# EAGLE design FubarStep_v11 (EAGLE 6.4)
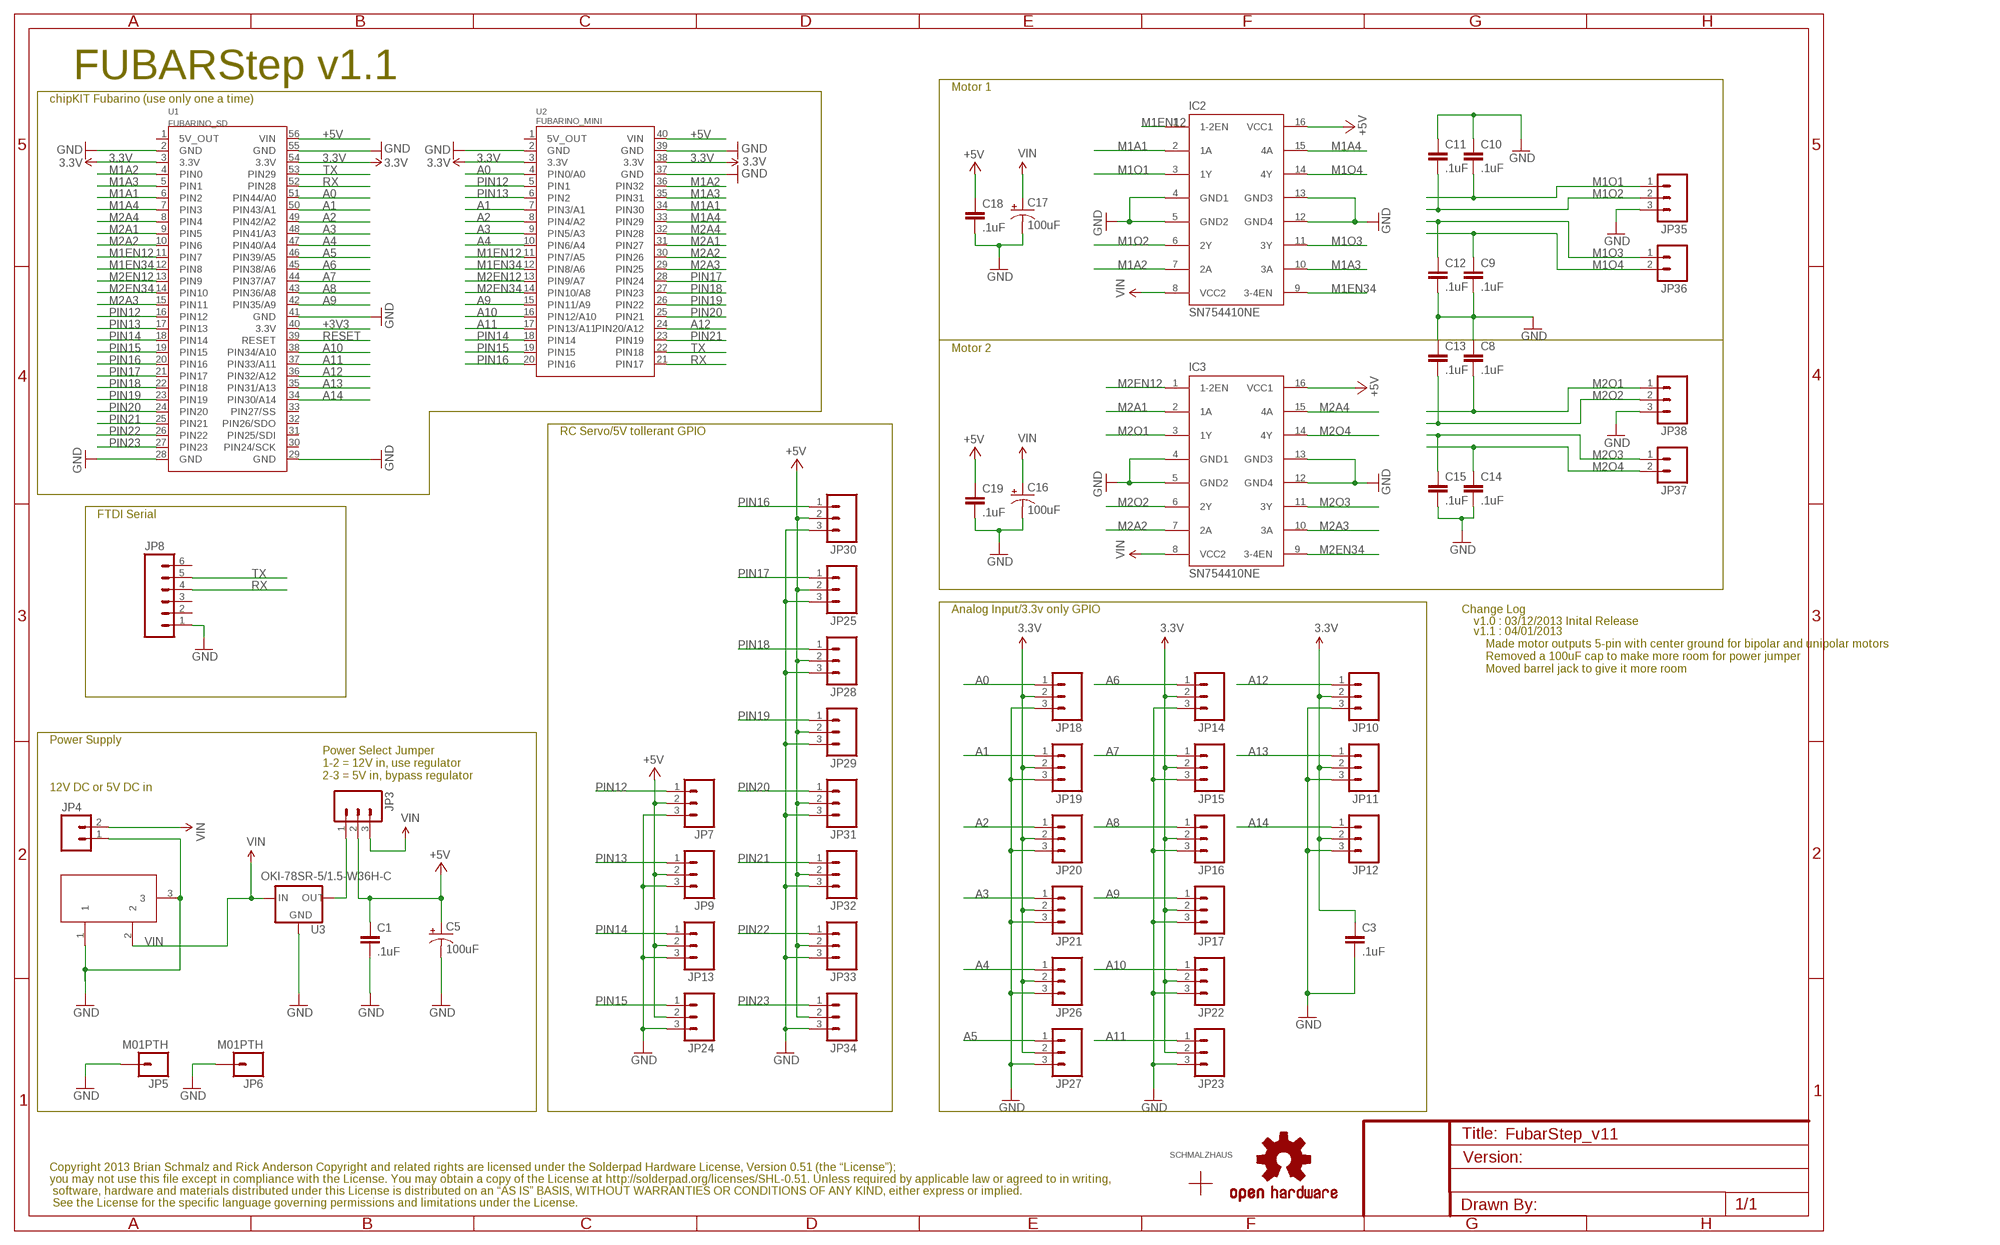
[diagram p0: schematic, sheet 1]

## Parts
C1  .1uF  CAPPTH  [CAP-PTH-SMALL]
C3  .1uF  CAPPTH  [CAP-PTH-SMALL]
C5  100uF  CAP_POLPTH1  [CPOL-RADIAL-100UF-25V]
C8  .1uF  CAPPTH  [CAP-PTH-SMALL]
C9  .1uF  CAPPTH  [CAP-PTH-SMALL]
C10  .1uF  CAPPTH  [CAP-PTH-SMALL]
C11  .1uF  CAPPTH  [CAP-PTH-SMALL]
C12  .1uF  CAPPTH  [CAP-PTH-SMALL]
C13  .1uF  CAPPTH  [CAP-PTH-SMALL]
C14  .1uF  CAPPTH  [CAP-PTH-SMALL]
C15  .1uF  CAPPTH  [CAP-PTH-SMALL]
C16  100uF  CAP_POLPTH1  [CPOL-RADIAL-100UF-25V]
C17  100uF  CAP_POLPTH1  [CPOL-RADIAL-100UF-25V]
C18  .1uF  CAPPTH  [CAP-PTH-SMALL]
C19  .1uF  CAPPTH  [CAP-PTH-SMALL]
IC2  SN754410NE  L293E  [DIL16]
IC3  SN754410NE  L293E  [DIL16]
JP3  M03PTH  [1X03]
JP4  M023.5MM  [SCREWTERMINAL-3.5MM-2]
JP5  M01PTH  [1X01]
JP6  M01PTH  [1X01]
JP7  M03PTH  [1X03]
JP8  M06LOCK  [1X06_LOCK]
JP9  M03PTH  [1X03]
JP10  M03PTH  [1X03]
JP11  M03PTH  [1X03]
JP12  M03PTH  [1X03]
JP13  M03PTH  [1X03]
JP14  M03PTH  [1X03]
JP15  M03PTH  [1X03]
JP16  M03PTH  [1X03]
JP17  M03PTH  [1X03]
JP18  M03PTH  [1X03]
JP19  M03PTH  [1X03]
JP20  M03PTH  [1X03]
JP21  M03PTH  [1X03]
JP22  M03PTH  [1X03]
JP23  M03PTH  [1X03]
JP24  M03PTH  [1X03]
JP25  M03PTH  [1X03]
JP26  M03PTH  [1X03]
JP27  M03PTH  [1X03]
JP28  M03PTH  [1X03]
JP29  M03PTH  [1X03]
JP30  M03PTH  [1X03]
JP31  M03PTH  [1X03]
JP32  M03PTH  [1X03]
JP33  M03PTH  [1X03]
JP34  M03PTH  [1X03]
JP35  M03SCREW  [SCREWTERMINAL-3.5MM-3]
JP36  M023.5MM  [SCREWTERMINAL-3.5MM-2]
JP37  M023.5MM  [SCREWTERMINAL-3.5MM-2]
JP38  M03SCREW  [SCREWTERMINAL-3.5MM-3]
LOGO1  OSHW-LOGOM  [OSHW-LOGO-M]
U1  FUBARINO_SD  [FUBARINO_SD]
U2  FUBARINO_MINI  [FUBARINO_MINI]
U3  OKI-78SR-5/1.5-W36H-C  V_REG_78XXSINK  [TO220-IGO]
U$1  SCHMALZHAUSSCHMALZHAUS_SMALL  [SCHMALZHAUS_SMALL]
X1  DC21MMX  [DC-21MM]

## Nets
3.3V: C3.1 JP10.2 JP11.2 JP12.2 JP14.2 JP15.2 JP16.2 JP17.2 JP18.2 JP19.2 JP20.2 JP21.2 JP22.2 JP23.2 JP26.2 JP27.2 U1.3(3.3V) U1.54(3.3V) U2.3(3.3V) U2.38(3.3V)
+3V3: U1.40(3.3V)
+5V: C1.1 C5.1(+) C18.1 C19.1 IC2.16(VCC1) IC3.16(VCC1) JP3.2 JP7.2 JP9.2 JP13.2 JP24.2 JP25.2 JP28.2 JP29.2 JP30.2 JP31.2 JP32.2 JP33.2 JP34.2 U1.56(VIN) U2.40(VIN)
A0: JP18.1 U1.51(PIN44/A0) U2.4(PIN0/A0)
A1: JP19.1 U1.50(PIN43/A1) U2.7(PIN3/A1)
A2: JP20.1 U1.49(PIN42/A2) U2.8(PIN4/A2)
A3: JP21.1 U1.48(PIN41/A3) U2.9(PIN5/A3)
A4: JP26.1 U1.47(PIN40/A4) U2.10(PIN6/A4)
A5: JP27.1 U1.46(PIN39/A5)
A6: JP14.1 U1.45(PIN38/A6)
A7: JP15.1 U1.44(PIN37/A7)
A8: JP16.1 U1.43(PIN36/A8)
A9: JP17.1 U1.42(PIN35/A9) U2.15(PIN11/A9)
A10: JP22.1 U1.38(PIN34/A10) U2.16(PIN12/A10)
A11: JP23.1 U1.37(PIN33/A11) U2.17(PIN13/A11)
A12: JP10.1 U1.36(PIN32/A12) U2.24(PIN20/A12)
A13: JP11.1 U1.35(PIN31/A13)
A14: JP12.1 U1.34(PIN30/A14)
GND: C1.2 C3.2 C5.2(-) C8.1 C9.2 C10.1 C11.1 C12.2 C13.1 C14.2 C15.2 C16.2(-) C17.2(-) C18.2 C19.2 IC2.4(GND1) IC2.5(GND2) IC2.12(GND4) IC2.13(GND3) IC3.4(GND1) IC3.5(GND2) IC3.12(GND4) IC3.13(GND3) JP4.1 JP5.1 JP6.1 JP7.3 JP8.1 JP9.3 JP10.3 JP11.3 JP12.3 JP13.3 JP14.3 JP15.3 JP16.3 JP17.3 JP18.3 JP19.3 JP20.3 JP21.3 JP22.3 JP23.3 JP24.3 JP25.3 JP26.3 JP27.3 JP28.3 JP29.3 JP30.3 JP31.3 JP32.3 JP33.3 JP34.3 JP35.3 JP38.3 U1.2(GND) U1.28(GND) U1.29(GND) U1.41(GND) U1.55(GND) U2.2(GND) U2.37(GND) U2.39(GND) U3.GND X1.1 X1.3
M1A1: IC2.2(1A) U1.6(PIN2) U2.34(PIN30)
M1A2: IC2.7(2A) U1.4(PIN0) U2.36(PIN32)
M1A3: IC2.10(3A) U1.5(PIN1) U2.35(PIN31)
M1A4: IC2.15(4A) U1.7(PIN3) U2.33(PIN29)
M1EN12: IC2.1(1-2EN) U1.11(PIN7) U2.11(PIN7/A5)
M1EN34: IC2.9(3-4EN) U1.12(PIN8) U2.12(PIN8/A6)
M1O1: C10.2 IC2.3(1Y) JP35.1
M1O2: C11.2 IC2.6(2Y) JP35.2
M1O3: C12.1 IC2.11(3Y) JP36.1
M1O4: C9.1 IC2.14(4Y) JP36.2
M2A1: IC3.2(1A) U1.9(PIN5) U2.31(PIN27)
M2A2: IC3.7(2A) U1.10(PIN6) U2.30(PIN26)
M2A3: IC3.10(3A) U1.15(PIN11) U2.29(PIN25)
M2A4: IC3.15(4A) U1.8(PIN4) U2.32(PIN28)
M2EN12: IC3.1(1-2EN) U1.13(PIN9) U2.13(PIN9/A7)
M2EN34: IC3.9(3-4EN) U1.14(PIN10) U2.14(PIN10/A8)
M2O1: C8.2 IC3.3(1Y) JP38.1
M2O2: C13.2 IC3.6(2Y) JP38.2
M2O3: C15.1 IC3.11(3Y) JP37.1
M2O4: C14.1 IC3.14(4Y) JP37.2
N$2: JP3.1 U3.OUT
PIN12: JP7.1 U1.16(PIN12) U2.5(PIN1)
PIN13: JP9.1 U1.17(PIN13) U2.6(PIN2)
PIN14: JP13.1 U1.18(PIN14) U2.18(PIN14)
PIN15: JP24.1 U1.19(PIN15) U2.19(PIN15)
PIN16: JP30.1 U1.20(PIN16) U2.20(PIN16)
PIN17: JP25.1 U1.21(PIN17) U2.28(PIN24)
PIN18: JP28.1 U1.22(PIN18) U2.27(PIN23)
PIN19: JP29.1 U1.23(PIN19) U2.26(PIN22)
PIN20: JP31.1 U1.24(PIN20) U2.25(PIN21)
PIN21: JP32.1 U1.25(PIN21) U2.23(PIN19)
PIN22: JP33.1 U1.26(PIN22)
PIN23: JP34.1 U1.27(PIN23)
RESET: U1.39(RESET)
RX: JP8.4 U1.52(PIN28) U2.21(PIN17)
TX: JP8.5 U1.53(PIN29) U2.22(PIN18)
VIN: C16.1(+) C17.1(+) IC2.8(VCC2) IC3.8(VCC2) JP3.3 JP4.2 U3.IN X1.2
Unconnected: JP8.2 JP8.3 JP8.6 U1.1(5V_OUT) U1.30(PIN24/SCK) U1.31(PIN25/SDI) U1.32(PIN26/SDO) U1.33(PIN27/SS) U2.1(5V_OUT)

## Notes on the sheet
- FUBARStep v1.1
- Motor 1
- chipKIT Fubarino (use only one a time)
- Motor 2
- RC Servo/5V tollerant GPIO
- FTDI Serial
- Analog Input/3.3v only GPIO | Change Log
- v1.0 : 03/12/2013 Inital Release
- v1.1 : 04/01/2013
      Made motor outputs 5-pin with center ground for bipolar and unipolar motors
      Removed a 100uF cap to make more room for power jumper
      Moved barrel jack to give it more room
- Power Supply
- Power Select Jumper
  1-2 = 12V in, use regulator
  2-3 = 5V in, bypass regulator
- 12V DC or 5V DC in
- Copyright 2013 Brian Schmalz and Rick Anderson Copyright and related rights are licensed under the Solderpad Hardware License, Version 0.51 (the “License”);
- you may not use this file except in compliance with the License. You may obtain a copy of the License at http://solderpad.org/licenses/SHL-0.51. Unless required by applicable law or agreed to in writing,
- software, hardware and materials distributed under this License is distributed on an “AS IS” BASIS, WITHOUT WARRANTIES OR CONDITIONS OF ANY KIND, either express or implied.
- See the License for the specific language governing permissions and limitations under the License.

## Library data of the parts
C1 C3 C8-C15 C18 C19 = SparkFun-Capacitors:CAP: Capacitor Standard 0603 ceramic capacitor, and 0.1" leaded capacitor.
C5 C16 C17 = SparkFun-Capacitors:CAP_POL: Capacitor Polarized These are standard SMD and PTH capacitors. Normally 10uF, 47uF, and 100uF in electrolytic and tantalum varieties. Always verify the external diameter of the through hole cap, it varies with capacity, voltage, and manufacturer. The EIA devices should be standard.
IC2 IC3 = texas:L293E: TI DEVICE; MF: Arrow Electronics; MPN: L293E; OC_FARNELL: 1467711; OC_NEWARK: 89K0732
JP3 JP7 JP9-JP35 JP38 = SparkFun-Connectors:M03: Header 3 Standard 3-pin 0.1" header. Use with straight break away headers (SKU : PRT-00116), right angle break away headers (PRT-00553), swiss pins (PRT-00743), machine pins (PRT-00117), and female headers (PRT-00115). Molex polarized connector foot print use with SKU : PRT-08232 with associated crimp pins and housings.
JP4 JP36 JP37 = SparkFun-Connectors:M02: Header 2 Standard 2-pin 0.1" header. Use with straight break away headers (SKU : PRT-00116), right angle break away headers (PRT-00553), swiss pins (PRT-00743), machine pins (PRT-00117), and female headers (PRT-00115). Molex polarized connector foot print use with SKU : PRT-08233 with associated crimp pins and housings.
JP5 JP6 = SparkFun-Connectors:M01: Header 1 Standard 1-pin 0.1" header. Use with straight break away headers (SKU : PRT-00116), right angle break away headers (PRT-00553), swiss pins (PRT-00743), machine pins (PRT-00117), and female headers (PRT-00115).
JP8 = SparkFun-Connectors:M06: Header 6 Standard 6-pin 0.1" header. Use with straight break away headers (SKU : PRT-00116), right angle break away headers (PRT-00553), swiss pins (PRT-00743), machine pins (PRT-00117), and female headers (PRT-00115). Molex polarized connector foot print use with SKU : PRT-08094 with associated crimp pins and housings. NOTES ON THE VARIANTS LOCK and LOCK_LONGPADS... This footprint was designed to help hold the alignment of a through-hole component (i.e. 6-pin header) while soldering it into place. You may notice that each hole has been shifted either up or down by 0.005 of an inch from it's more standard position (which is a perfectly straight line). This slight alteration caused the pins (the squares in the middle) to touch the edges of the holes. Because they are alternating, it causes a "brace" to hold the component in place. 0.005 has proven to be the perfect amount of "off-center" position when using our standard breakaway headers. Although looks a little odd when you look at the bare footprint, once you have a header in there, the alteration is very hard to notice. Also, if you push a header all the way into place, it is covered up entirely on the bottom side. This idea of altering the position of holes to aid alignment will be further integrated into the Sparkfun Library for other footprints. It can help hold any component with 3 or more connection pins.
LOGO1 = SparkFun-Aesthetics:OSHW-LOGO: Open Source Hardware Logo This logo indicates the piece of hardware it is found on incorporates a OSHW license and/or adheres to the definition of open source hardware found here: http://freedomdefined.org/OSHW
U1 = SchmalzHausPublic:FUBARINO_SD
U2 = SchmalzHausPublic:FUBARINO_MINI
U3 = SparkFun-PowerIC:V_REG_78XX: Voltage Regulator Standard 7805 5V regulator. IGO (Input Ground Output). Spark Fun Electronics SKU : COM-00107
U$1 = SchmalzHaus:SCHMALZHAUS
X1 = powersupply:DC21MM

## Net classes
0 default: width 0.152 mm, drill 0.305 mm, clearance 0.152 mm

## Board
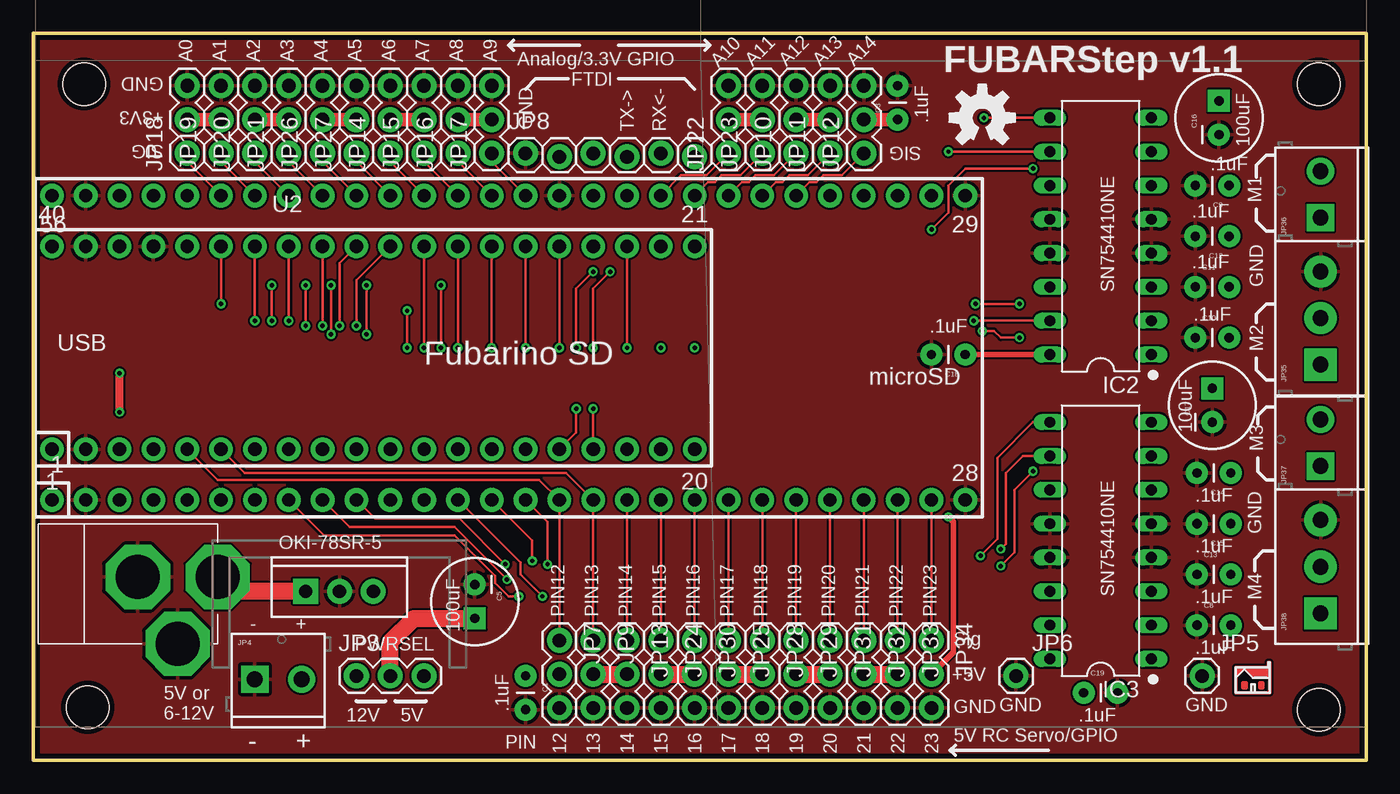
[diagram p1: board, top side]
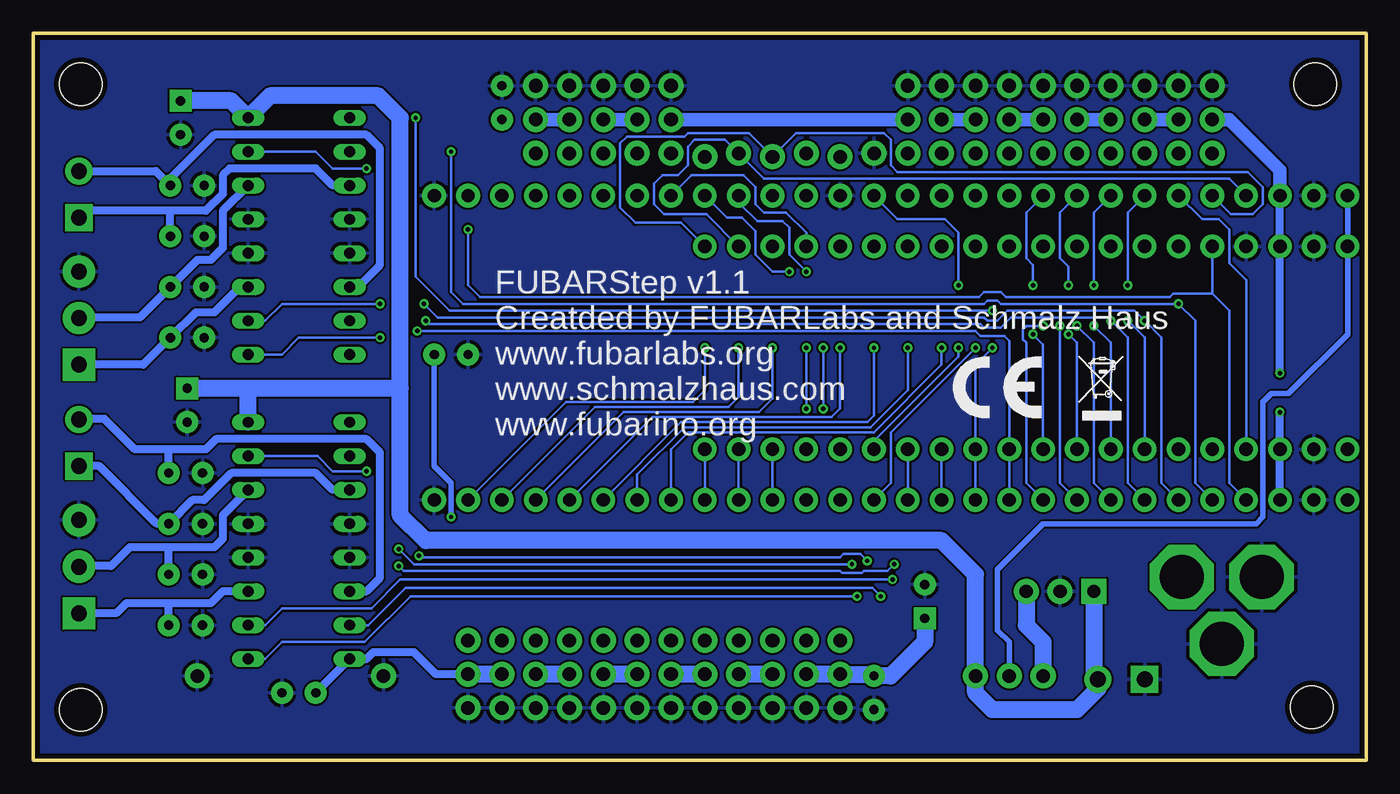
[diagram p2: board, bottom side, seen from below]

Size 100.08 x 54.61 mm. Coordinates in mm from the lower left corner, seen from the top.
Outline: 0,54.61 100.08,54.61 100.08,0 0,0 0,54.61
Copper layers (1*16): Top 0.0356mm / dielectric 1.5011mm / Bottom 0.0356mm
Design rules "LaenPCBOrder_BPSmods": minimum track width 6mil, minimum drill 13mil, track to track 6mil, track to pad 6mil, pad to pad 6mil, via to via 6mil, smd to smd 6mil, copper to edge 15mil, drill to drill 6mil, minimum pad ring 7mil, minimum via ring 7mil, stop-mask expansion 4mil, vias tented up to drill 30mil, thermal gap 10mil
Holes 3.2 mm at 96.52,50.8 96.52,3.81 3.81,50.8 4.08,3.98

### Footprints (pad centres in the part's own frame; a part is rotated, then mirrored left to right if it is on the bottom)
CAP-PTH-SMALL = drill 0.7 pad 1.651: 1 0,0; 2 2.54,0
CPOL-RADIAL-100UF-25V = drill 0.7 pad 1.651 square: 1 1.27,0 | drill 0.7 pad 1.651: 2 -1.27,0
DIL16 = drill 0.813 long: 1 -8.89,-3.81; 2 -6.35,-3.81; 3 -3.81,-3.81; 4 -1.27,-3.81; 5 1.27,-3.81; 6 3.81,-3.81; 7 6.35,-3.81; 8 8.89,-3.81; 9 8.89,3.81; 10 6.35,3.81; 11 3.81,3.81; 12 1.27,3.81; 13 -1.27,3.81; 14 -3.81,3.81; 15 -6.35,3.81; 16 -8.89,3.81
1X03 = drill 1.016 pad 1.88: 1 0,0; 2 2.54,0; 3 5.08,0
SCREWTERMINAL-3.5MM-2 = drill 1.2 pad 2.032 square: 1 0,0 | drill 1.2 pad 2.032: 2 3.5,0
1X01 = drill 1.016 pad 1.88: 1 0,0
1X06_LOCK = drill 1.016 pad 1.88: 1 0,0; 2 2.54,-0.254; 3 5.08,0; 4 7.62,-0.254; 5 10.16,0; 6 12.7,-0.254
SCREWTERMINAL-3.5MM-3 = drill 1.2 pad 2.413 square: 1 0,0 | drill 1.2 pad 2.413: 2 3.5,0; 3 7,0
FUBARINO_SD = drill 1 pad 1.778: 1 -34.29,-11.43; 2 -31.75,-11.43; 3 -29.21,-11.43; 4 -26.67,-11.43; 5 -24.13,-11.43; 6 -21.59,-11.43; 7 -19.05,-11.43; 8 -16.51,-11.43; 9 -13.97,-11.43; 10 -11.43,-11.43; 11 -8.89,-11.43; 12 -6.35,-11.43; 13 -3.81,-11.43; 14 -1.27,-11.43; 15 1.27,-11.43; 16 3.81,-11.43; 17 6.35,-11.43; 18 8.89,-11.43; 19 11.43,-11.43; 20 13.97,-11.43; 21 16.51,-11.43; 22 19.05,-11.43; 23 21.59,-11.43; 24 24.13,-11.43; 25 26.67,-11.43; 26 29.21,-11.43; 27 31.75,-11.43; 28 34.29,-11.43; 29 34.29,11.43; 30 31.75,11.43; 31 29.21,11.43; 32 26.67,11.43; 33 24.13,11.43; 34 21.59,11.43; 35 19.05,11.43; 36 16.51,11.43; 37 13.97,11.43; 38 11.43,11.43; 39 8.89,11.43; 40 6.35,11.43; 41 3.81,11.43; 42 1.27,11.43; 43 -1.27,11.43; 44 -3.81,11.43; 45 -6.35,11.43; 46 -8.89,11.43; 47 -11.43,11.43; 48 -13.97,11.43; 49 -16.51,11.43; 50 -19.05,11.43; 51 -21.59,11.43; 52 -24.13,11.43; 53 -26.67,11.43; 54 -29.21,11.43; 55 -31.75,11.43; 56 -34.29,11.43
FUBARINO_MINI = drill 1 pad 1.778: 1 -24.13,-7.62; 2 -21.59,-7.62; 3 -19.05,-7.62; 4 -16.51,-7.62; 5 -13.97,-7.62; 6 -11.43,-7.62; 7 -8.89,-7.62; 8 -6.35,-7.62; 9 -3.81,-7.62; 10 -1.27,-7.62; 11 1.27,-7.62; 12 3.81,-7.62; 13 6.35,-7.62; 14 8.89,-7.62; 15 11.43,-7.62; 16 13.97,-7.62; 17 16.51,-7.62; 18 19.05,-7.62; 19 21.59,-7.62; 20 24.13,-7.62; 21 24.13,7.62; 22 21.59,7.62; 23 19.05,7.62; 24 16.51,7.62; 25 13.97,7.62; 26 11.43,7.62; 27 8.89,7.62; 28 6.35,7.62; 29 3.81,7.62; 30 1.27,7.62; 31 -1.27,7.62; 32 -3.81,7.62; 33 -6.35,7.62; 34 -8.89,7.62; 35 -11.43,7.62; 36 -13.97,7.62; 37 -16.51,7.62; 38 -19.05,7.62; 39 -21.59,7.62; 40 -24.13,7.62
TO220-IGO = drill 1 pad 1.88: GND 0,0; OUT 2.54,0 | drill 1 pad 1.88 square: IN -2.54,0
DC-21MM = drill 3.302 pad 4.826 octagon: 1 -5.08,-3.353; 2 -0.076,-6.35; 3 -0.076,-0.356

### Placement (x,y rotation side)
C1  36.96,6.35 270 top
C3  64.9,48.13 90 top
C5  33.15,11.94 270 top
C8  87.38,10.16 0 top
C9  89.79,43.18 180 top
C10  87.25,31.75 0 top
C11  87.25,35.56 0 top
C12  89.79,39.37 180 top
C13  87.38,13.97 0 top
C14  89.92,21.59 180 top
C15  89.92,17.78 180 top
C16  89.03,48.26 90 top
C17  88.52,26.67 90 top
C18  69.98,30.48 180 top
C19  78.87,5.08 0 top
IC2  80.14,39.37 90 top
IC3  80.14,16.51 90 top
JP3  24.26,6.35 0 top
JP4  16.64,6.1 0 top
JP5  87.76,6.35 0 top
JP6  73.79,6.35 0 top
JP7  39.5,9.02 270 top
JP8  36.96,45.59 0 top
JP9  42.04,9.02 270 top
JP10  57.28,45.59 90 top
JP11  59.82,45.59 90 top
JP12  62.36,45.59 90 top
JP13  44.58,9.02 270 top
JP14  26.8,45.59 90 top
JP15  29.34,45.59 90 top
JP16  31.88,45.59 90 top
JP17  34.42,45.59 90 top
JP18  11.56,45.59 90 top
JP19  14.1,45.59 90 top
JP20  16.64,45.59 90 top
JP21  19.18,45.59 90 top
JP22  52.2,45.59 90 top
JP23  54.74,45.59 90 top
JP24  47.12,9.02 270 top
JP25  52.2,9.02 270 top
JP26  21.72,45.59 90 top
JP27  24.26,45.59 90 top
JP28  54.74,9.02 270 top
JP29  57.28,9.02 270 top
JP30  49.66,9.02 270 top
JP31  59.82,9.02 270 top
JP32  62.36,9.02 270 top
JP33  64.9,9.02 270 top
JP34  67.44,9.02 270 top
JP35  96.65,29.72 90 top
JP36  96.65,40.77 90 top
JP37  96.65,22.1 90 top
JP38  96.65,11.05 90 top
LOGO1  71.25,48.26 0 top
U1  35.69,30.99 0 top
U2  25.53,30.99 0 top
U3  22.99,12.7 0 top
U$1  91.57,5.08 0 top
U$2  [ROHS_GARBAGE_5MM]  21.59,25.53 0 bottom
U$3  [CE_5MM]  27.69,28.07 0 bottom
X1  7.49,13.84 90 top

### Tracks (layer width: path | path; a pad name or v marks a point on that pad's centre or on a via)
3.3V  (via drill 0.33)
  Top 0.61: v6.48,26.16 v6.48,29.08
  Top 1.016: C3.1 JP12.2 | JP11.2 JP10.2 | JP23.2 JP22.2 | JP17.2 JP16.2 | JP15.2 JP14.2 | JP27.2 JP26.2 | JP21.2 JP20.2 | JP19.2 JP18.2
  Bottom 0.61: U1.3 U2.3 v6.48,26.16 | U1.54 U2.38 v6.48,29.08
  Bottom 1.016: U1.54 6.48,44.32 10.29,48.13 JP18.2 | JP19.2 JP20.2 | JP21.2 JP26.2 | JP27.2 JP14.2 | JP15.2 JP16.2 | JP17.2 JP22.2 | JP23.2 JP10.2 | JP11.2 JP12.2
+5V  (via drill 0.33)
  Top 0.406: JP34.2 69.09,8.13 69.09,17.91 v68.71,18.29 | C18.1 IC2.16
  Top 1.27: JP9.2 JP13.2 | JP24.2 JP30.2 | JP25.2 JP28.2 | JP29.2 JP31.2 | JP32.2 JP33.2 | JP3.2 26.8,8.89 28.57,10.67 C5.1
  Bottom 0.203: 37.08,6.48 C1.1
  Bottom 0.406: U1.56 U2.40 1.4,32 5.84,27.56 7.11,27.56 7.75,26.92 7.75,18.29 8.26,17.78 24.26,17.78 27.69,14.35 27.69,9.78 26.8,8.89 JP3.2 | v68.71,18.29 68.71,20.83 69.98,22.1 C18.1
  Bottom 0.61: JP34.2 69.85,6.48 71.5,8.13 74.55,8.13 75.06,7.62 IC3.16 C19.1
  Bottom 1.27: JP9.2 JP7.2 37.08,6.48 | JP13.2 JP24.2 | JP30.2 JP25.2 | JP28.2 JP29.2 | JP31.2 JP32.2 | JP33.2 JP34.2 | C5.1 33.15,8.89 35.69,6.35 C1.1
A0
  Top 0.152: U1.51 11.56,44.96 JP18.1
  Bottom 0.203: U2.4 9.02,36.07 10.29,37.34 10.29,39.88 11.05,40.64 12.32,40.64 U1.51
A1  (via drill 0.33)
  Top 0.152: U1.50 14.1,44.96 JP19.1
  Top 0.203: v17.91,33.02 v17.91,35.69
  Bottom 0.203: U2.7 16.64,31.75 v17.91,33.02 | v17.91,35.69 17.91,41.15 U1.50
A2  (via drill 0.33)
  Top 0.152: U1.49 16.64,44.96 JP20.1
  Top 0.203: v20.45,32.64 v20.45,35.69
  Bottom 0.203: U2.8 19.18,31.37 v20.45,32.64 | v20.45,35.69 20.45,41.15 U1.49
A3  (via drill 0.33)
  Top 0.152: U1.48 19.18,44.96 JP21.1
  Top 0.203: v22.35,32 v22.35,35.69
  Bottom 0.203: U2.9 21.72,31.37 v22.35,32 | v22.35,35.69 22.35,37.08 22.99,37.72 22.99,41.15 U1.48
A4  (via drill 0.33)
  Top 0.152: U1.47 21.72,44.96 JP26.1
  Top 0.203: v25.02,32 v25.02,35.69
  Bottom 0.203: U2.10 24.26,31.24 v25.02,32 | v25.02,35.69 25.02,37.21 25.53,37.72 25.53,41.15 U1.47
A5
  Top 0.152: U1.46 24.26,44.96 JP27.1
A6
  Top 0.152: U1.45 26.8,44.96 JP14.1
A7
  Top 0.152: U1.44 29.34,44.96 JP15.1
A8
  Top 0.152: U1.43 31.88,44.96 JP16.1
A9  (via drill 0.33)
  Top 0.152: U1.42 34.42,44.96 JP17.1
  Top 0.203: v30.61,30.99 v30.61,35.69
  Bottom 0.203: U2.15 36.96,24 30.61,30.35 v30.61,30.99 | v30.61,35.69 30.61,39.62 31.62,40.64 35.18,40.64 U1.42
A10  (via drill 0.33)
  Top 0.203: U1.38 48.64,43.94 50.55,43.94 JP22.1 | U2.16 40.77,24.64 v40.77,26.42 | v40.77,30.99 40.77,35.43 v42.04,36.7
  Bottom 0.203: v40.77,26.42 v40.77,30.99 | v42.04,36.7 43.31,37.97 43.31,40.01 43.82,40.51 45.72,40.51 47.12,41.91 U1.38
A11  (via drill 0.33)
  Top 0.203: U1.37 50.67,43.43 51.18,43.43 51.69,43.94 53.09,43.94 JP23.1 | U2.17 v42.04,26.42 | v42.04,30.99 42.04,35.43 v43.31,36.7
  Bottom 0.203: v42.04,26.42 v42.04,30.99 | v43.31,36.7 44.58,36.7 45.85,37.97 45.85,39.75 46.86,40.77 48.01,40.77 U1.37
A12
  Top 0.203: U1.36 53.21,43.43 53.72,43.43 54.23,43.94 55.63,43.94 JP10.1
  Bottom 0.203: U2.24 42.04,39.62 43.56,41.15 45.21,41.15 45.85,41.78 45.85,43.05 46.74,43.94 50.67,43.94 U1.36
A13
  Top 0.203: U1.35 55.75,43.43 56.26,43.43 56.77,43.94 58.17,43.94 JP11.1
A14
  Top 0.203: U1.34 58.29,43.43 58.8,43.43 59.31,43.94 60.71,43.94 JP12.1
GND
  pour Bottom (rank 2): 0,54.61 100.08,54.61 100.08,0 0,0
  pour Top (rank 2): 0,54.61 100.08,54.61 100.08,0 0,0
M1A1  (via drill 0.33)
  Top 0.203: v74.04,34.29 v70.74,34.29 | U2.34 v16.64,33.02
  Bottom 0.203: IC2.2 82.68,33.02 81.41,34.29 v74.04,34.29 | v70.74,34.29 69.72,33.27 28.7,33.27 28.45,33.02 27.69,33.02 26.92,33.78 17.4,33.78 v16.64,33.02 15.37,31.75 15.37,20.83 U1.6
M1A2  (via drill 0.33)
  Top 0.203: v75.06,44.45 69.98,44.45 68.71,43.18 68.71,41.15 v67.44,39.88
  Bottom 0.203: IC2.7 78.87,45.72 77.6,44.45 v75.06,44.45 | v67.44,39.88 67.44,35.69 66.55,34.8 29.08,34.8 28.7,35.18 27.43,35.18 27.05,34.8 14.73,34.8 14.48,35.05 11.56,35.05 | U1.4 10.29,20.83 10.29,33.78 11.56,35.05 | 11.56,35.05 U2.36
M1A3  (via drill 0.33)
  Top 0.203: IC2.10 v68.71,45.72 | U2.35 v14.1,34.29
  Bottom 0.203: v68.71,45.72 68.71,35.18 67.82,34.29 28.7,34.29 28.45,34.54 27.69,34.54 27.43,34.29 v14.1,34.29 12.83,33.02 12.83,20.83 U1.5
M1A4  (via drill 0.33)
  Top 0.203: IC2.15 v70.61,33.02 | U2.33 v19.18,33.02
  Bottom 0.203: v70.61,33.02 70.36,32.77 28.96,32.77 28.7,32.51 27.43,32.51 26.67,33.27 19.43,33.27 v19.18,33.02 17.91,31.75 17.91,20.83 U1.7
M1EN12  (via drill 0.33)
  Top 0.203: v74.04,31.75 72.64,31.75 72.14,32.26 v71.25,32.26
  Bottom 0.203: IC2.1 81.41,30.48 80.14,31.75 v74.04,31.75 | v71.25,32.26 29.34,32.26 28.96,31.88 27.18,31.88 26.8,31.5 U2.11 U1.11
M1EN34  (via drill 0.33)
  Top 0.203: IC2.9 v71.37,48.26 | v28.07,30.99 v28.07,33.78
  Bottom 0.203: v71.37,48.26 71.37,36.32 68.83,33.78 v28.07,33.78 | U1.12 U2.12 29.34,29.72 v28.07,30.99
M1O1
  Bottom 0.61: IC2.3 84.58,35.56 86.49,33.66 87.88,33.66 C10.2 91.82,29.72 JP35.1
M1O2
  Bottom 0.61: IC2.6 85.85,41.27 85.85,38.48 86.74,37.59 87.76,37.59 C11.2 92.07,33.27 96.59,33.27 JP35.2
M1O3
  Bottom 0.61: IC2.11 77.6,43.18 78.87,44.45 85.34,44.45 85.85,43.94 85.85,42.55 87.12,41.27 89.66,41.27 | 89.66,41.27 96.14,41.27 JP36.1 | C12.1 89.79,41.15 89.66,41.27
M1O4
  Bottom 0.61: IC2.14 75.69,35.56 74.04,37.21 74.04,45.97 75.06,46.99 86.49,46.99 89.79,43.69 C9.1 90.88,44.27 JP36.2
M2A1  (via drill 0.33)
  Top 0.203: U1.9 23.75,17.53 31.62,17.53 v35.56,13.59 | U2.31 22.99,37.34 v22.99,32.64
  Bottom 0.203: IC3.2 82.68,10.16 81.41,11.43 74.68,11.43 72.52,13.59 v35.56,13.59 | v22.99,32.64 22.99,20.83 U1.9
M2A2  (via drill 0.33)
  Top 0.203: v75.06,21.72 73.66,20.32 73.66,15.62 v72.64,14.61 | U1.10 25.65,18.16 32,18.16 v35.43,14.73 | U2.30 24.26,36.07 v24.26,32.64
  Bottom 0.203: IC3.7 78.74,22.86 77.6,21.72 v75.06,21.72 | v72.64,14.61 72.26,14.22 39.5,14.22 39.37,14.1 37.85,14.1 37.72,14.22 35.94,14.22 v35.43,14.73 | U1.10 25.53,20.83 25.53,31.37 25.78,31.62 25.78,32.38 25.53,32.64 v24.26,32.64
M2A3  (via drill 0.33)
  Top 0.203: IC3.10 74.3,22.86 73.02,21.59 73.02,16.26 v72.64,15.88 | v38.61,14.73 38.61,17.91 U1.15 | v29.34,30.99 U2.29
  Bottom 0.203: v72.64,15.88 71.5,14.73 v38.61,14.73 | U1.15 35.69,20.83 35.69,24.64 v29.34,30.99
M2A4  (via drill 0.33)
  Top 0.203: U1.8 21.84,16.89 31.62,16.89 34.67,13.84 34.67,13.34 35.69,12.32 v36.45,12.32 | U2.32 v21.72,32.64
  Bottom 0.203: IC3.15 74.93,10.16 72.14,12.95 37.08,12.95 v36.45,12.32 | v21.72,32.64 20.45,31.37 20.45,20.83 U1.8
M2EN12  (via drill 0.33)
  Top 0.203: v38.23,12.32 36.58,13.97 36.58,14.86 U1.13
  Bottom 0.203: IC3.1 82.68,7.62 81.41,8.89 75.18,8.89 71.75,12.32 v38.23,12.32 | U2.13 U1.13
M2EN34  (via drill 0.33)
  Top 0.203: IC3.9 75.06,25.4 72.39,22.73 72.39,16.64 v71.12,15.37 | v37.47,14.99 37.47,16.51 U1.14
  Bottom 0.203: v71.12,15.37 70.99,15.24 39.5,15.24 39.24,15.49 37.97,15.49 v37.47,14.99 | U2.14 U1.14
M2O1
  Bottom 0.61: IC3.3 85.85,12.7 86.74,11.81 89.92,11.81 | 89.92,11.81 93.09,11.81 93.85,11.05 JP38.1 | C8.2 89.92,11.81
M2O2
  Bottom 0.61: IC3.6 85.85,18.41 85.85,16.64 86.49,16 89.92,16 | 89.92,16 92.84,16 94.23,14.61 96.59,14.61 JP38.2 | C13.2 89.92,16
M2O3
  Bottom 0.61: IC3.11 77.6,20.32 78.87,21.59 85.22,21.59 87.25,19.56 88.14,19.56 C15.1 90.8,17.78 95.12,22.1 JP37.1
M2O4
  Bottom 0.61: IC3.14 75.06,12.7 74.04,13.72 74.04,23.11 75.06,24.13 86.36,24.13 87.12,23.37 90.04,23.37 | 90.04,23.37 92.46,23.37 94.74,25.65 96.59,25.65 JP37.2 | C14.1 89.92,23.24 90.04,23.37
N$2
  Bottom 1.27: U3.OUT 25.53,10.16 24.26,8.89 JP3.1
PIN12
  Top 0.203: JP7.1 U1.16 37.97,21.08 13.84,21.08 U2.5
PIN13
  Top 0.203: JP9.1 U1.17 40.01,21.59 15.88,21.59 U2.6
PIN14
  Top 0.203: U1.18 JP13.1
  Bottom 0.203: U2.18 U1.18
PIN15
  Top 0.203: U1.19 JP24.1
  Bottom 0.203: U2.19 U1.19
PIN16
  Top 0.203: JP30.1 U1.20
  Bottom 0.203: U2.20 U1.20
PIN17  (via drill 0.33)
  Top 0.203: JP25.1 U1.21 | U2.28 v31.88,30.99
  Bottom 0.203: v31.88,30.99 31.88,29.72 36.96,24.64 50.93,24.64 52.2,23.37 U1.21
PIN18  (via drill 0.33)
  Top 0.203: U1.22 JP28.1 | U2.27 v34.42,30.99
  Bottom 0.203: v34.42,30.99 34.42,27.81 37.21,25.02 51.18,25.02 54.74,21.46 U1.22
PIN19  (via drill 0.33)
  Top 0.203: JP29.1 U1.23 | U2.26 v36.96,30.99
  Bottom 0.203: v36.96,30.99 36.96,25.91 37.47,25.4 51.44,25.4 U1.23
PIN20  (via drill 0.33)
  Top 0.203: U1.24 JP31.1 | U2.25 v39.5,30.99
  Bottom 0.203: v39.5,30.99 39.5,26.42 40.13,25.78 53.59,25.78 U1.24
PIN21  (via drill 0.33)
  Top 0.203: JP32.1 U1.25 | U2.23 v44.58,30.99
  Bottom 0.203: v44.58,30.99 44.58,27.18 45.59,26.16 55.75,26.16 U1.25
PIN22  (via drill 0.33)
  Top 0.203: U1.26 JP33.1
  Bottom 0.203: v47.12,30.99 47.12,27.3 47.88,26.54 57.91,26.54 U1.26
PIN23  (via drill 0.33)
  Top 0.203: JP34.1 U1.27
  Bottom 0.203: v49.66,30.99 49.66,27.81 50.55,26.92 60.07,26.92 U1.27
RX
  Bottom 0.203: U2.21 51.44,40.39 54.86,40.39 56.01,41.53 56.01,46.35 55.5,46.86 51.18,46.86 50.93,47.12 46.36,47.12 JP8.4 42.8,47.12 36.2,47.12 35.69,46.61 35.69,44.7 35.18,44.2 8.89,44.2 7.75,43.05 7.75,41.78 8.51,41.02 10.16,41.02 U1.52
TX
  Bottom 0.203: U1.53 10.29,43.69 45.21,43.69 JP8.5 48.13,46.61 50.42,46.61 50.93,46.1 50.93,44.7 51.69,43.94 52.83,43.94 53.47,43.31 53.47,41.78 52.71,41.02 49.53,41.02 U2.22
VIN
  Top 1.27: X1.2 14.91,12.7 U3.IN
  Bottom 0.61: JP4.2 20.45,6.41
  Bottom 1.27: 72.52,27.94 72.52,18.41 70.61,16.51 31.88,16.51 29.34,13.97 JP3.3 29.34,5.08 28.07,3.81 21.72,3.81 20.14,5.39 JP4.2 | 72.52,27.94 83.95,27.94 | 83.95,27.94 C17.1 | 72.52,27.94 72.52,48.26 74.17,49.91 82.3,49.91 IC2.8 85.22,49.53 C16.1 | IC3.8 83.95,27.94 | U3.IN 20.45,6.41

### Text on the board
tPlace: A0 | A1 | A2 | A3 | A4 | A5 | A6 | A7 | A8 | A9 | Analog/3.3V GPIO | A10 | A11 | A12 | A13 | A14 | FUBARStep v1.1 | GND | FTDI | +3V3 | .1uF | GND | TX-> | RX<- | SIG | SIG | 100uF | .1uF | M1 | .1uF | .1uF | GND | SN754410NE | .1uF | .1uF | M2 | 100uF | M3 | .1uF | GND | OKI-78SR-5 | .1uF | SN754410NE | .1uF | M4 | PIN12 | PIN13 | PIN14 | PIN15 | PIN16 | PIN17 | PIN18 | PIN19 | PIN20 | PIN21 | PIN22 | PIN23 | - | + | 100uF | Sig | PWRSEL | .1uF | +5V | .1uF | GND | GND | GND | 5V or / 6-12V | 12V | 5V | .1uF | - | + | PIN | 12 | 13 | 14 | 15 | 16 | 17 | 18 | 19 | 20 | 21 | 22 | 23 | 5V RC Servo/GPIO
bPlace: FUBARStep v1.1 / Creatded by FUBARLabs and Schmalz Haus / www.fubarlabs.org / www.schmalzhaus.com / www.fubarino.org
Document: ANALOG INPUTS/3.3V GPIO | FTDI | SERVO OUTPUTS/5V GPIO
214bmp: D:/SmartProjects/Snc/a4_bn_logo2.bmp